# EAGLE design OTII-Breakout (EAGLE 9.6.2)
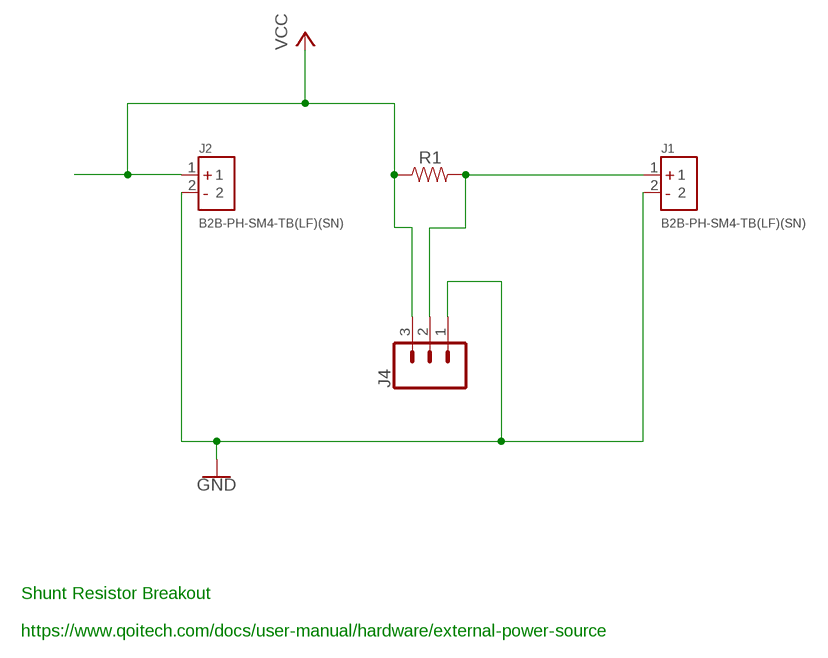
[diagram p0: schematic, sheet 1]

## Parts
J1  B2B-PH-SM4-TB(LF)(SN)  [JST_B2B-PH-SM4-TB(LF)(SN)]
J2  B2B-PH-SM4-TB(LF)(SN)  [JST_B2B-PH-SM4-TB(LF)(SN)]
J4  CONN_03  [1X03]
R1  RESISTOR-MF-0805  [0805]

## Nets
GND: J1.2 J2.2 J4.1
N$3: J1.1 J4.2 R1.2
VCC: J2.1 J4.3 R1.1

## Notes on the sheet
- Shunt Resistor Breakout
  
  https://www.qoitech.com/docs/user-manual/hardware/external-power-source

## Library data of the parts
J1 J2 = Custom Components:B2B-PH-SM4-TB(LF)(SN): PH Series 2 Position 2 mm Pitch Surface Mount Top Entry Shrouded Header; DESCRIPTION: Connector Header Surface Mount 2 position 0.079 (2.00mm); DIGI-KEY_PART_NUMBER: 455-1734-1-ND; MF: JST Sales; MP: B2B-PH-SM4-TB(LF)(SN); PACKAGE: None; PURCHASE-URL: https://pricing.snapeda.com/search/part/B2B-PH-SM4-TB(LF)(SN)/?ref=eda
J4 = SparkFun-Connectors:CONN_03: Multi connection point. Often used as Generic Header-pin footprint for 0.1 inch spaced/style header connections On any of the 0.1 inch spaced packages, you can populate with these: Break Away Headers - Straight <https://www.sparkfun.com/products/116> (PRT-00116) Break Away Male Headers - Right Angle <https://www.sparkfun.com/products/553> (PRT-00553) Female Headers <https://www.sparkfun.com/products/115> (PRT-00115) Break Away Headers - Machine Pin <https://www.sparkfun.com/products/117> (PRT-00117) Break Away Female Headers - Swiss Machine Pin <https://www.sparkfun.com/products/743> (PRT-00743) Stackable Header - 3 Pin (Female, 0.1") <https://www.sparkfun.com/products/13875> (PRT-13875) For SCREWTERMINALS and SPRING TERMINALS visit here: Screw Terimnals on SparkFun.com <https://www.sparkfun.com/search/results?term=Screw+Terminals> (5mm/3.5mm/2.54mm spacing) This device is also useful as a general connection point to wire up your design to another part of your project. Our various solder wires solder well into these plated through hole pads. Hook-Up Wire - Assortment (Stranded, 22 AWG) <https://www.sparkfun.com/products/11375> (PRT-11375) Hook-Up Wire - Assortment (Solid Core, 22 AWG) <https://www.sparkfun.com/products/11367> (PRT-11367) View the entire wire category on our website here <https://www.sparkfun.com/categories/141> Special notes: Molex polarized connector foot print use with SKU : PRT-08232 with associated crimp pins and housings.
R1 = Custom Components:RESISTOR-MF-: Generic 0805 Resistor Package

## Board
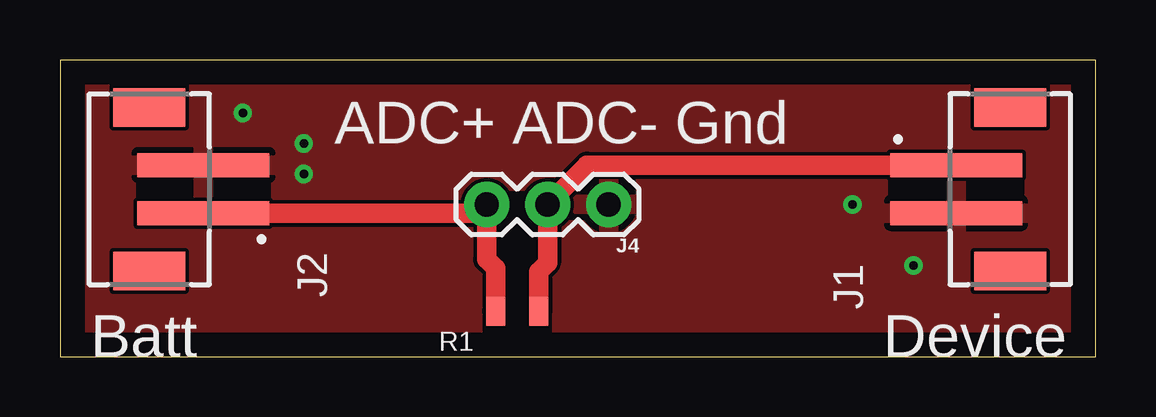
[diagram p1: board, top side]
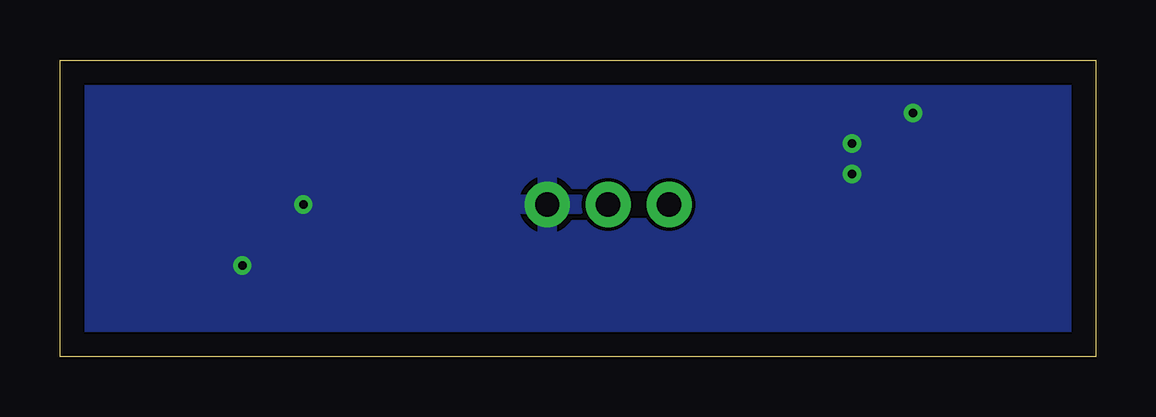
[diagram p2: board, bottom side, seen from below]

Size 43.16 x 12.37 mm. Coordinates in mm from the lower left corner, seen from the top.
Outline: 0,0 43.16,0 43.16,12.37 0,12.37 0,0
Copper layers (1*16): Top 0.035mm / dielectric 1.5mm / Bottom 0.035mm
Design rules "default": minimum track width 6mil, minimum drill 0.35mm, track to track 6mil, track to pad 6mil, pad to pad 6mil, via to via 6mil, smd to smd 6mil, copper to edge 40mil, drill to drill 6mil, minimum pad ring 10mil, minimum via ring 8mil, stop-mask expansion 4mil, vias tented up to drill 0mil, thermal gap 10mil

### Footprints (pad centres in the part's own frame; a part is rotated, then mirrored left to right if it is on the bottom)
JST_B2B-PH-SM4-TB(LF)(SN) = smd 1 x 5.5: 1 -1,0; 2 1,0 | smd 1.6 x 3: 3 -3.4,2.25; 4 3.4,2.25
1X03 = drill 1.016 pad 1.88: 1 0,0; 2 2.54,0; 3 5.08,0
0805 = smd 0.8 x 1.2: 1 -0.9,0; 2 0.9,0

### Placement (x,y rotation side)
J1  37.34,6.99 270 top
J2  5.97,6.99 90 top
J4  22.86,6.35 180 top
R1  19.05,1.91 0 top

### Tracks (layer width: path | path; a pad name or v marks a point on that pad's centre or on a via)
GND  (via drill 0.35)
  other vias: 10.16,8.89 10.16,7.62 7.62,10.16 35.56,3.81 33.02,6.35
  pour Top: -1.27,13.97 45.72,13.97 45.72,-1.27 -1.27,-1.27
  pour Bottom: -1.27,13.97 44.45,13.97 44.45,-2.54 -1.27,-2.54
N$3
  Top 0.813: R1.2 19.95,3.56 20.32,3.93 J4.2 21.95,7.99 J1.1
VCC
  Top 0.813: J2.1 17.41,5.99 J4.3 17.78,4.06 18.15,3.69 R1.1

### Text on the board
tPlace: ADC+ ADC- Gnd | Batt | Device